# Altium schematic sheet S7CAS-PLEIADES-CARTE-MERE_P20_Power-Tree-4.SchDoc
size Tabloid; SheetNumber: 18; SheetTotal: 18; Sheet_Name: Power Tree 4/4; Size: 11x17
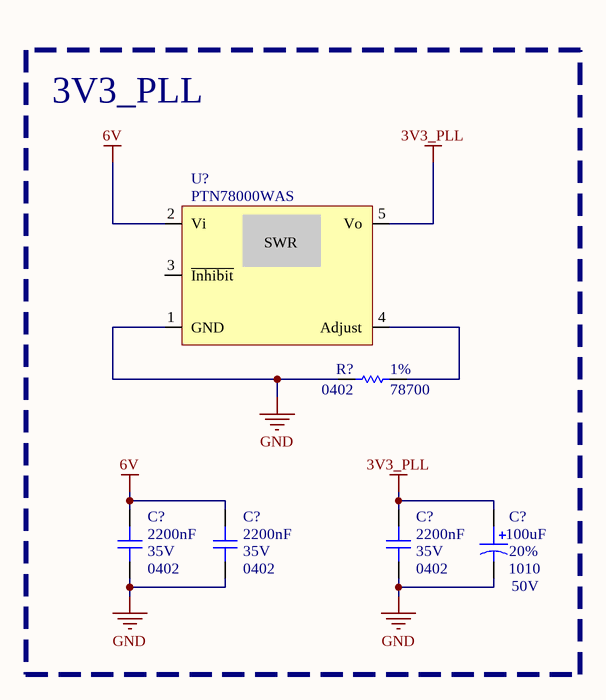
[diagram p0: S7CAS-PLEIADES-CARTE-MERE_P20_Power-Tree-4.SchDoc]

## Parts
(Parts that share a designator on the sheet are numbered #1, #2 ... from top to bottom, then left to right.)
C?#1  value 2200nF  Voltage: 35V  Package: 0402  [CAP_0402]  (hidden comment: CAP - 0402)
C?#2  value 2200nF  Voltage: 35V  Package: 0402  [CAP_0402]  (hidden comment: CAP - 0402)
C?#3  value 2200nF  Voltage: 35V  Package: 0402  [CAP_0402]  (hidden comment: CAP - 0402)
C?#4  value 100uF  Voltage: 50V  Package: 1010  Precision: 20%  [CAP_ALU_1010_vishay]  (hidden comment: MAL215099101E3)
R?  value 78700  Package: 0402  Precision: 1%  [RES_0402]  (hidden comment: RES - 0402)
U?  PTN78000WAS

## Blocks framed on the sheet
3V3_PLL: C?#1-C?#4 R? U?

## Nets
3V3_PLL: C?#3.2 C?#4.1 U?.5(Vo)
6V: C?#1.2 C?#2.2 U?.2(Vi)
GND: C?#1.1 C?#2.1 C?#3.1 C?#4.2 R?.1 U?.1(GND)
NetR?_2: R?.2 U?.4(Adjust)

Not connected (* = marked no-connect by the designer): U? 3(~{Inhibit})

## Notes on the sheet
- Sheet Name
- Project Title
- Global Project
- Size
- Group
- Revision
- Date
- Sheet
- of
- Filename
- Designers
- (in symbol REG_SWR_PTN78000X) / SWR

## Library data of the parts
C?#1-C?#3 = CAP - 0402: Mfg Part Number: ZRB157R6YA225KE11; Precision: 10%; Current: *; CreatedBy: Jonathan Bouchard; Power: *
C?#4 = CAP_ALU_MAL215099101E3: CAP - ALU 100uF 20% 50V - 1010; Current: 490mA; Mfg: Vishay Dale; Mfg Part Number: MAL215099101E3; HelpURL: http://www.vishay.com/docs/28395/150crz.pdf; CreatedBy: Jonathan Bouchard; Temperature: -55°C to 125°C; Power: *; Supplier 1: Digikey; Supplier Part Number 1: 4399PHDKR-ND
R? = RES - 0402: Mfg Part Number: SFR01MZPF7872; Voltage: 50V; Power: 1/16W; CreatedBy: Jonathan Bouchard
U? = REG_SWR_PTN78000X: XXX - Description - Package; GRAMS Lib Spec: 2.7; HelpURL: https://www.ti.com/lit/ds/symlink/ptn78000h.pdf?HQS=dis-dk-null-digikeymode-dsf-pf-null-wwe&ts=1706608276519&ref_url=https%253A%252F%252Fwww.ti.com%252Fgeneral%252Fdocs%252Fsuppproductinfo.tsp%253FdistId%253D10%2526gotoUrl%253Dhttps%253A%252F%252Fwww.ti.com%252Flit%252Fgpn%252Fptn78000h